# EAGLE design ssr_ansteuerung_v7 (EAGLE 6.4)
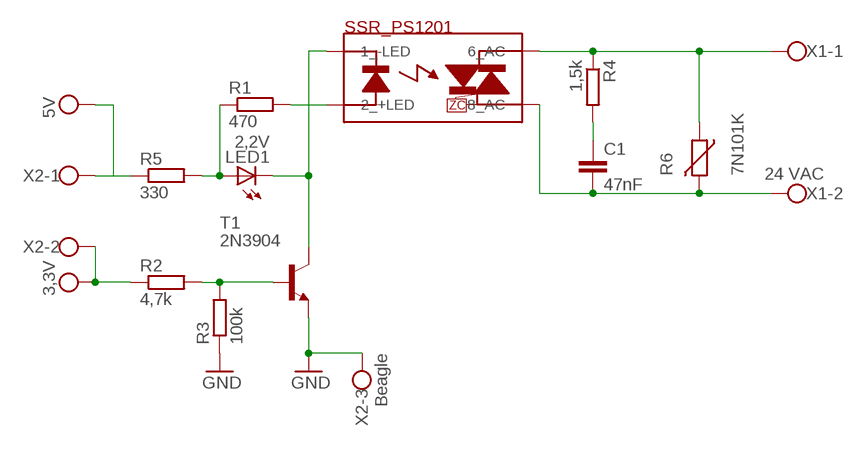
[diagram p0: schematic, sheet 1]

## Parts
C1  47nF  C7.5/3  [C7.5B3]
LED1  2,2V  LED5MM  [LED5MM]
R1  470  R-EU_0204/7  [0204/7]
R2  4,7k  R-EU_0204/7  [0204/7]
R3  100k  R-EU_0204/7  [0204/7]
R4  1,5k  R-EU_0204/7  [0204/7]
R5  330  R-EU_0204/7  [0204/7]
R6  7N101K  VARISTOR-5  [R-5]
SSR_PS1201  SSR PS1201  IXYS_PS1201_SSRSIP4/8  [S202S02]
T1  2N3904  [TO92]
X1  24 VAC  W237-102  [W237-102]
X2  Beagle  W237-103  [W237-103]

## Nets
GND: R3.1 T1.3(E) X2.3
N$1: R1.2 SSR_PS1201.2(2_+LED)
N$2: LED1.A R1.1 R5.2
N$3: R2.2 R3.2 T1.2(B)
N$4: LED1.K(C) SSR_PS1201.1(1_-LED) T1.1(C)
N$5: C1.1 R4.2
N$6: R4.1 R6.1 SSR_PS1201.6(6_AC) X1.1
N$7: C1.2 R6.2 SSR_PS1201.8(8_AC) X1.2
N$8: R5.1 X2.1
VCC: R2.1 X2.2 ; supply symbol labelled 3,3V, 5V

## Library data of the parts
C1 = capacitor-wima:C: CAPACITOR naming: grid - package width
LED1 = led:LED: LED OSRAM: - CHIPLED LG R971, LG N971, LY N971, LG Q971, LY Q971, LO R971, LY R971 LH N974, LH R974 LS Q976, LO Q976, LY Q976 LO Q996 - Hyper CHIPLED LW Q18S LB Q993, LB Q99A, LB R99A - SideLED LS A670, LO A670, LY A670, LG A670, LP A670 LB A673, LV A673, LT A673, LW A673 LH A674 LY A675 LS A676, LA A676, LO A676, LY A676, LW A676 LS A679, LY A679, LG A679 - Hyper Micro SIDELED® LS Y876, LA Y876, LO Y876, LY Y876 LT Y87S - SmartLED LW L88C, LW L88S LB L89C, LB L89S, LG L890 LS L89K, LO L89K, LY L89K LS L896, LA L896, LO L896, LY L896 - TOPLED LS T670, LO T670, LY T670, LG T670, LP T670 LSG T670, LSP T670, LSY T670, LOP T670, LYG T670 LG T671, LOG T671, LSG T671 LB T673, LV T673, LT T673, LW T673 LH T674 LS T676, LA T676, LO T676, LY T676, LB T676, LH T676, LSB T676, LW T676 LB T67C, LV T67C, LT T67C, LS T67K, LO T67K, LY T67K, LW E67C LS E67B, LA E67B, LO E67B, LY E67B, LB E67C, LV E67C, LT E67C LW T67C LS T679, LY T679, LG T679 LS T770, LO T770, LY T770, LG T770, LP T770 LB T773, LV T773, LT T773, LW T773 LH T774 LS E675, LA E675, LY E675, LS T675 LS T776, LA T776, LO T776, LY T776, LB T776 LHGB T686 LT T68C, LB T68C - Hyper Mini TOPLED® LB M676 - Mini TOPLED Santana® LG M470 LS M47K, LO M47K, LY M47K Source: http://www.osram.convergy.de LUXEON: - LUMILED® LXK2-PW12-R00, LXK2-PW12-S00, LXK2-PW14-U00, LXK2-PW14-V00 LXK2-PM12-R00, LXK2-PM12-S00, LXK2-PM14-U00 LXK2-PE12-Q00, LXK2-PE12-R00, LXK2-PE12-S00, LXK2-PE14-T00, LXK2-PE14-U00 LXK2-PB12-K00, LXK2-PB12-L00, LXK2-PB12-M00, LXK2-PB14-N00, LXK2-PB14-P00, LXK2-PB14-Q00 LXK2-PR12-L00, LXK2-PR12-M00, LXK2-PR14-Q00, LXK2-PR14-R00 LXK2-PD12-Q00, LXK2-PD12-R00, LXK2-PD12-S00 LXK2-PH12-R00, LXK2-PH12-S00 LXK2-PL12-P00, LXK2-PL12-Q00, LXK2-PL12-R00 Source: www.luxeon.com KINGBRIGHT: KA-3528ASYC Source: www.kingbright.com
R1-R5 = rcl:R-EU_: RESISTOR, European symbol
R6 = varistor:VARISTOR: VARISTOR
SSR_PS1201 = SPuls:IXYS_PS1201_SSR
T1 = transistor:2N3904: NPN TRANSISTOR
X1 = con-wago-500:W237-102: WAGO SCREW CLAMP; MPN: 237-102; OC_FARNELL: unknown; OC_NEWARK: 70K9898
X2 = con-wago-500:W237-103: WAGO SCREW CLAMP; MPN: 237-103; OC_FARNELL: unknown; OC_NEWARK: 18M7116

## Board
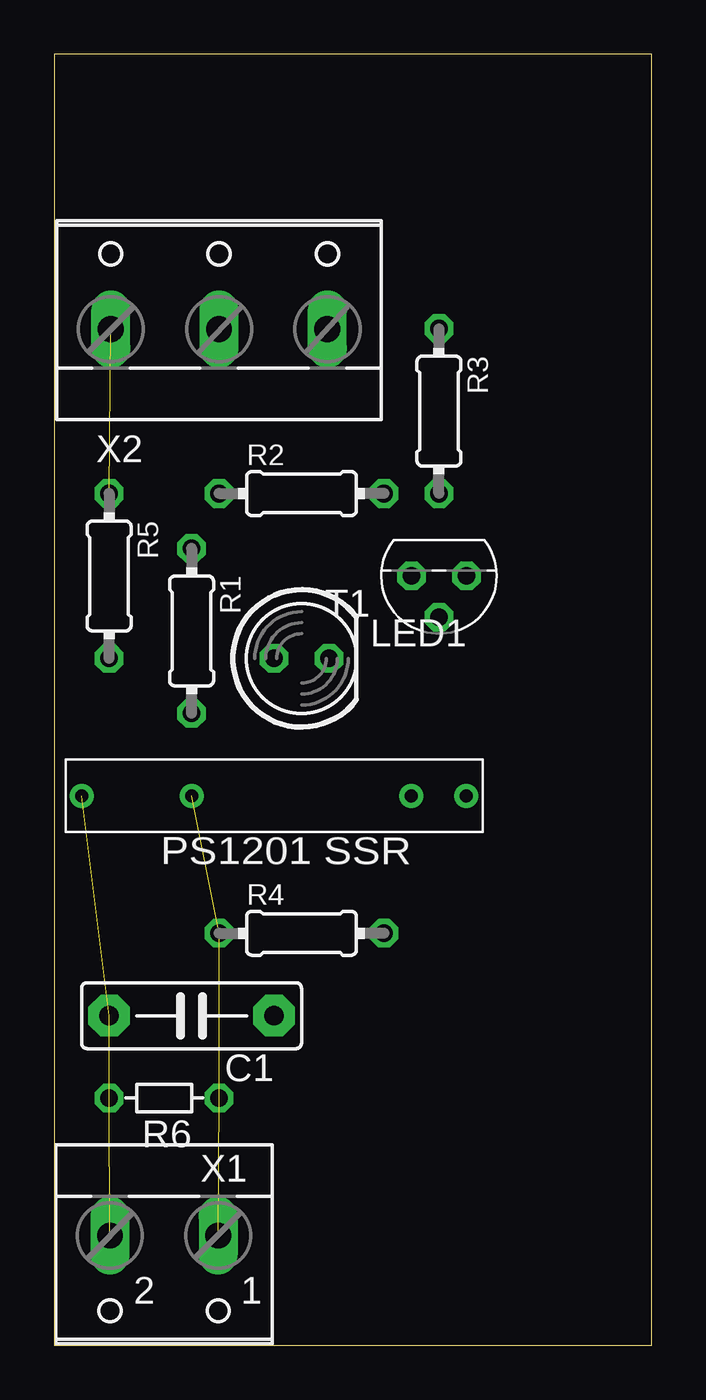
[diagram p1: board, top side]
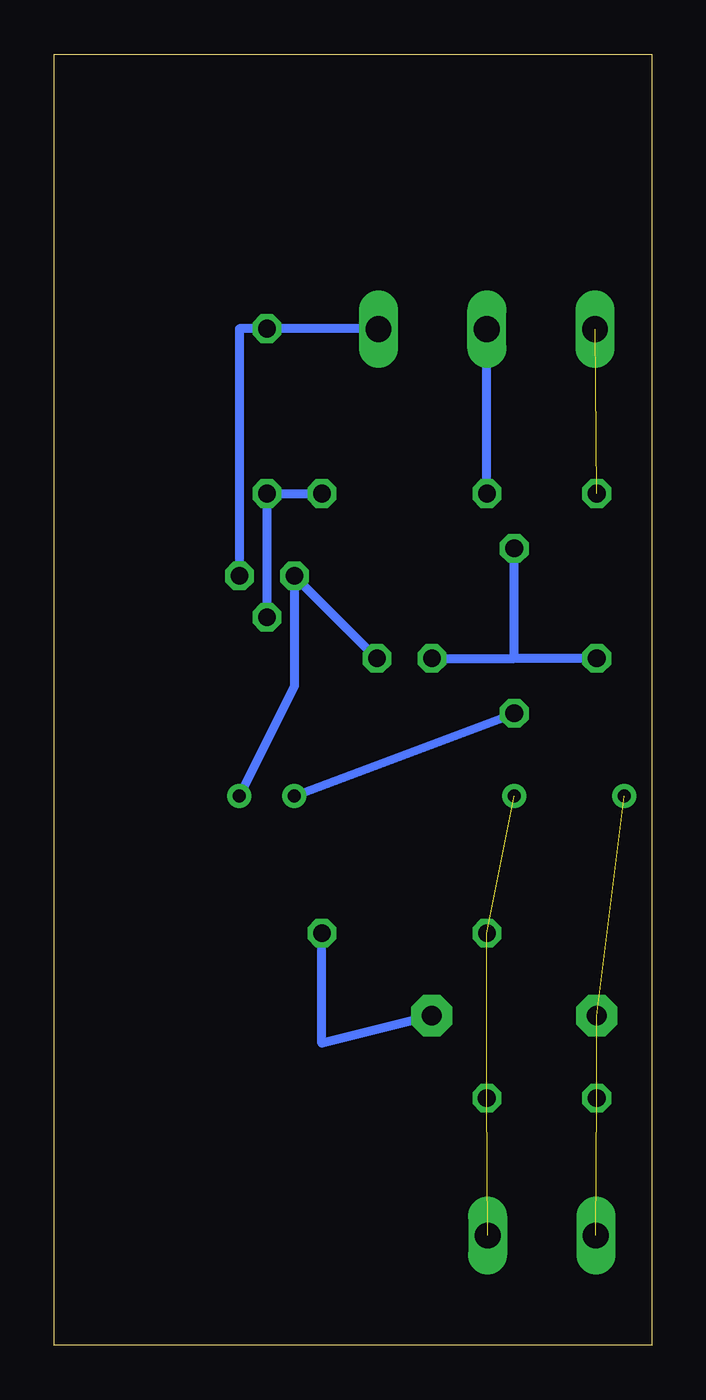
[diagram p2: board, bottom side, seen from below]

Size 27.61 x 59.68 mm. Coordinates in mm from the lower left corner, seen from the top.
Outline: 0,0 27.61,0 27.61,59.68 0,59.68 0,0
Copper layers (1*16): Top 0.035mm / dielectric 1.5mm / Bottom 0.035mm
Design rules "default": minimum track width 10mil, minimum drill 24mil, track to track 8mil, track to pad 8mil, pad to pad 8mil, via to via 8mil, smd to smd 8mil, copper to edge 40mil, drill to drill 8mil, minimum pad ring 10mil, minimum via ring 8mil, stop-mask expansion 4mil, vias tented up to drill 0mil, thermal gap 10mil

### Footprints (pad centres in the part's own frame; a part is rotated, then mirrored left to right if it is on the bottom)
C7.5B3 = drill 0.914 pad 1.905 octagon: 1 -3.81,0; 2 3.81,0
LED5MM = drill 0.813 octagon: A -1.27,0; K 1.27,0
0204/7 = drill 0.813 octagon: 1 -3.81,0; 2 3.81,0
R-5 = drill 0.813 octagon: 1 -2.54,0; 2 2.54,0
S202S02 = drill 0.6: 1 -7.62,0; 2 -5.08,0; 6 5.08,0; 8 10.16,0
TO92 = drill 0.813 octagon: 1 1.27,0; 2 0,1.905; 3 -1.27,0
W237-102 = drill 1.194 long: 1 -2.5,-1.27; 2 2.5,-1.27
W237-103 = drill 1.194 long: 1 -5,-1.29; 2 0,-1.29; 3 5,-1.29

### Placement (x,y rotation side)
C1  6.35,15.24 180 top
LED1  11.43,31.75 0 top
R1  6.35,33.02 270 top
R2  11.43,39.37 0 top
R3  17.78,43.18 270 top
R4  11.43,19.05 0 top
R5  2.54,35.56 270 top
R6  5.08,11.43 180 top
SSR_PS1201  11.43,25.4 180 top
T1  17.78,35.56 180 top
X1  5.08,3.81 180 top
X2  7.62,48.26 0 top

### Tracks (layer width: path | path; a pad name or v marks a point on that pad's centre or on a via)
GND
  Bottom 0.406: X2.3 12.62,46.99 R3.1 19.05,46.99 T1.3
N$1
  Bottom 0.406: SSR_PS1201.2 R1.2
N$2
  Bottom 0.406: R5.2 6.35,31.75 | 6.35,31.75 R1.1 | LED1.A 6.35,31.75
N$3
  Bottom 0.406: R2.2 R3.2 T1.2
N$4
  Bottom 0.406: SSR_PS1201.1 16.51,30.48 T1.1 LED1.K
N$5
  Bottom 0.406: C1.1 15.24,13.97 R4.2
N$6  (3 unrouted)
N$7  (3 unrouted)
N$8  (1 unrouted)
VCC
  Bottom 0.406: R2.1 X2.2